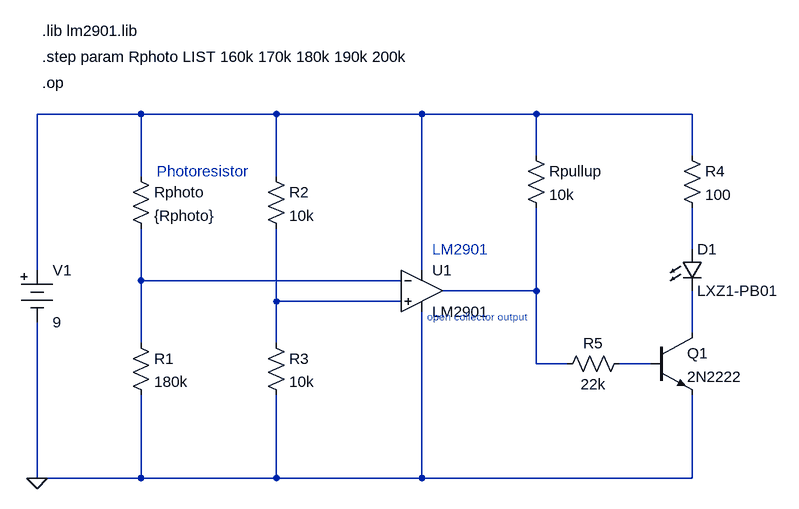
[diagram p0: schematic night-light.asc]
night-light.asc, the LTspice schematic file:
Version 4
SHEET 1 1228 680
WIRE 128 -112 -32 -112
WIRE 336 -112 128 -112
WIRE 560 -112 336 -112
WIRE 736 -112 560 -112
WIRE 976 -112 736 -112
WIRE 736 -48 736 -112
WIRE 976 -48 976 -112
WIRE 128 -16 128 -112
WIRE 336 -16 336 -112
WIRE 976 96 976 32
WIRE -32 128 -32 -112
WIRE 560 128 560 -112
WIRE 128 144 128 64
WIRE 528 144 128 144
WIRE 736 160 736 32
WIRE 736 160 592 160
WIRE 336 176 336 64
WIRE 528 176 336 176
WIRE 976 224 976 160
WIRE 128 240 128 144
WIRE 336 240 336 176
WIRE 736 272 736 160
WIRE 784 272 736 272
WIRE 912 272 864 272
WIRE -32 448 -32 208
WIRE 128 448 128 320
WIRE 128 448 -32 448
WIRE 336 448 336 320
WIRE 336 448 128 448
WIRE 560 448 560 192
WIRE 560 448 336 448
WIRE 976 448 976 320
WIRE 976 448 560 448
FLAG -32 448 0
SYMBOL Misc\\battery -32 112 R0
WINDOW 123 0 0 Left 0
WINDOW 39 0 0 Left 0
SYMATTR InstName V1
SYMATTR Value 9
SYMBOL res 112 -32 R0
SYMATTR InstName Rphoto
SYMATTR Value {Rphoto}
SYMBOL res 112 224 R0
SYMATTR InstName R1
SYMATTR Value 180k
SYMBOL res 320 -32 R0
SYMATTR InstName R2
SYMATTR Value 10k
SYMBOL res 320 224 R0
SYMATTR InstName R3
SYMATTR Value 10k
SYMBOL OpAmps\\UniversalOpAmp 560 160 R0
SYMATTR InstName U1
SYMATTR Value LM2901
SYMBOL res 720 -64 R0
SYMATTR InstName Rpullup
SYMATTR Value 10k
SYMBOL res 960 -64 R0
SYMATTR InstName R4
SYMATTR Value 100
SYMBOL LED 960 96 R0
SYMATTR InstName D1
SYMATTR Value LXZ1-PB01
SYMATTR Description Diode
SYMATTR Type diode
SYMBOL npn 912 224 R0
SYMATTR InstName Q1
SYMATTR Value 2N2222
SYMBOL res 768 288 R270
WINDOW 0 32 56 VTop 2
WINDOW 3 0 56 VBottom 2
SYMATTR InstName R5
SYMATTR Value 22k
TEXT 152 -24 Left 2 ;Photoresistor
TEXT -24 -240 Left 2 !.lib lm2901.lib
TEXT 576 96 Left 2 ;LM2901
TEXT -24 -200 Left 2 !.step param Rphoto LIST 160k 170k 180k 190k 200k
TEXT -24 -160 Left 2 !.op
TEXT 568 200 Left 1 ;open collector output

The netlist it stands for:
* night-light.asc
V1 N001 0 9
Rphoto N001 N003 {Rphoto}
R1 N003 0 180k
R2 N001 N005 10k
R3 N005 0 10k
XU1 N005 N003 N001 0 N004 level1 LM2901 Avol=1Meg GBW=10Meg Vos=0 En=0 Enk=0 In=0 Ink=0 Rin=500Meg  ; pins In+ In- V+ V- OUT
Rpullup N001 N004 10k
R4 N001 N002 100
D1 N002 N006 LXZ1-PB01
Q1 N006 N007 0 0 2N2222
R5 N004 N007 22k
.model D D
.lib standard.dio
.model NPN NPN
.model PNP PNP
.lib standard.bjt
* Photoresistor
.lib lm2901.lib
* LM2901
.step param Rphoto LIST 160k 170k 180k 190k 200k
.op
* open collector output
.lib UniversalOpAmp1.lib
.backanno
.end